# EAGLE design Lower Board (EAGLE 5.12)
PARTNO: 43045-0406
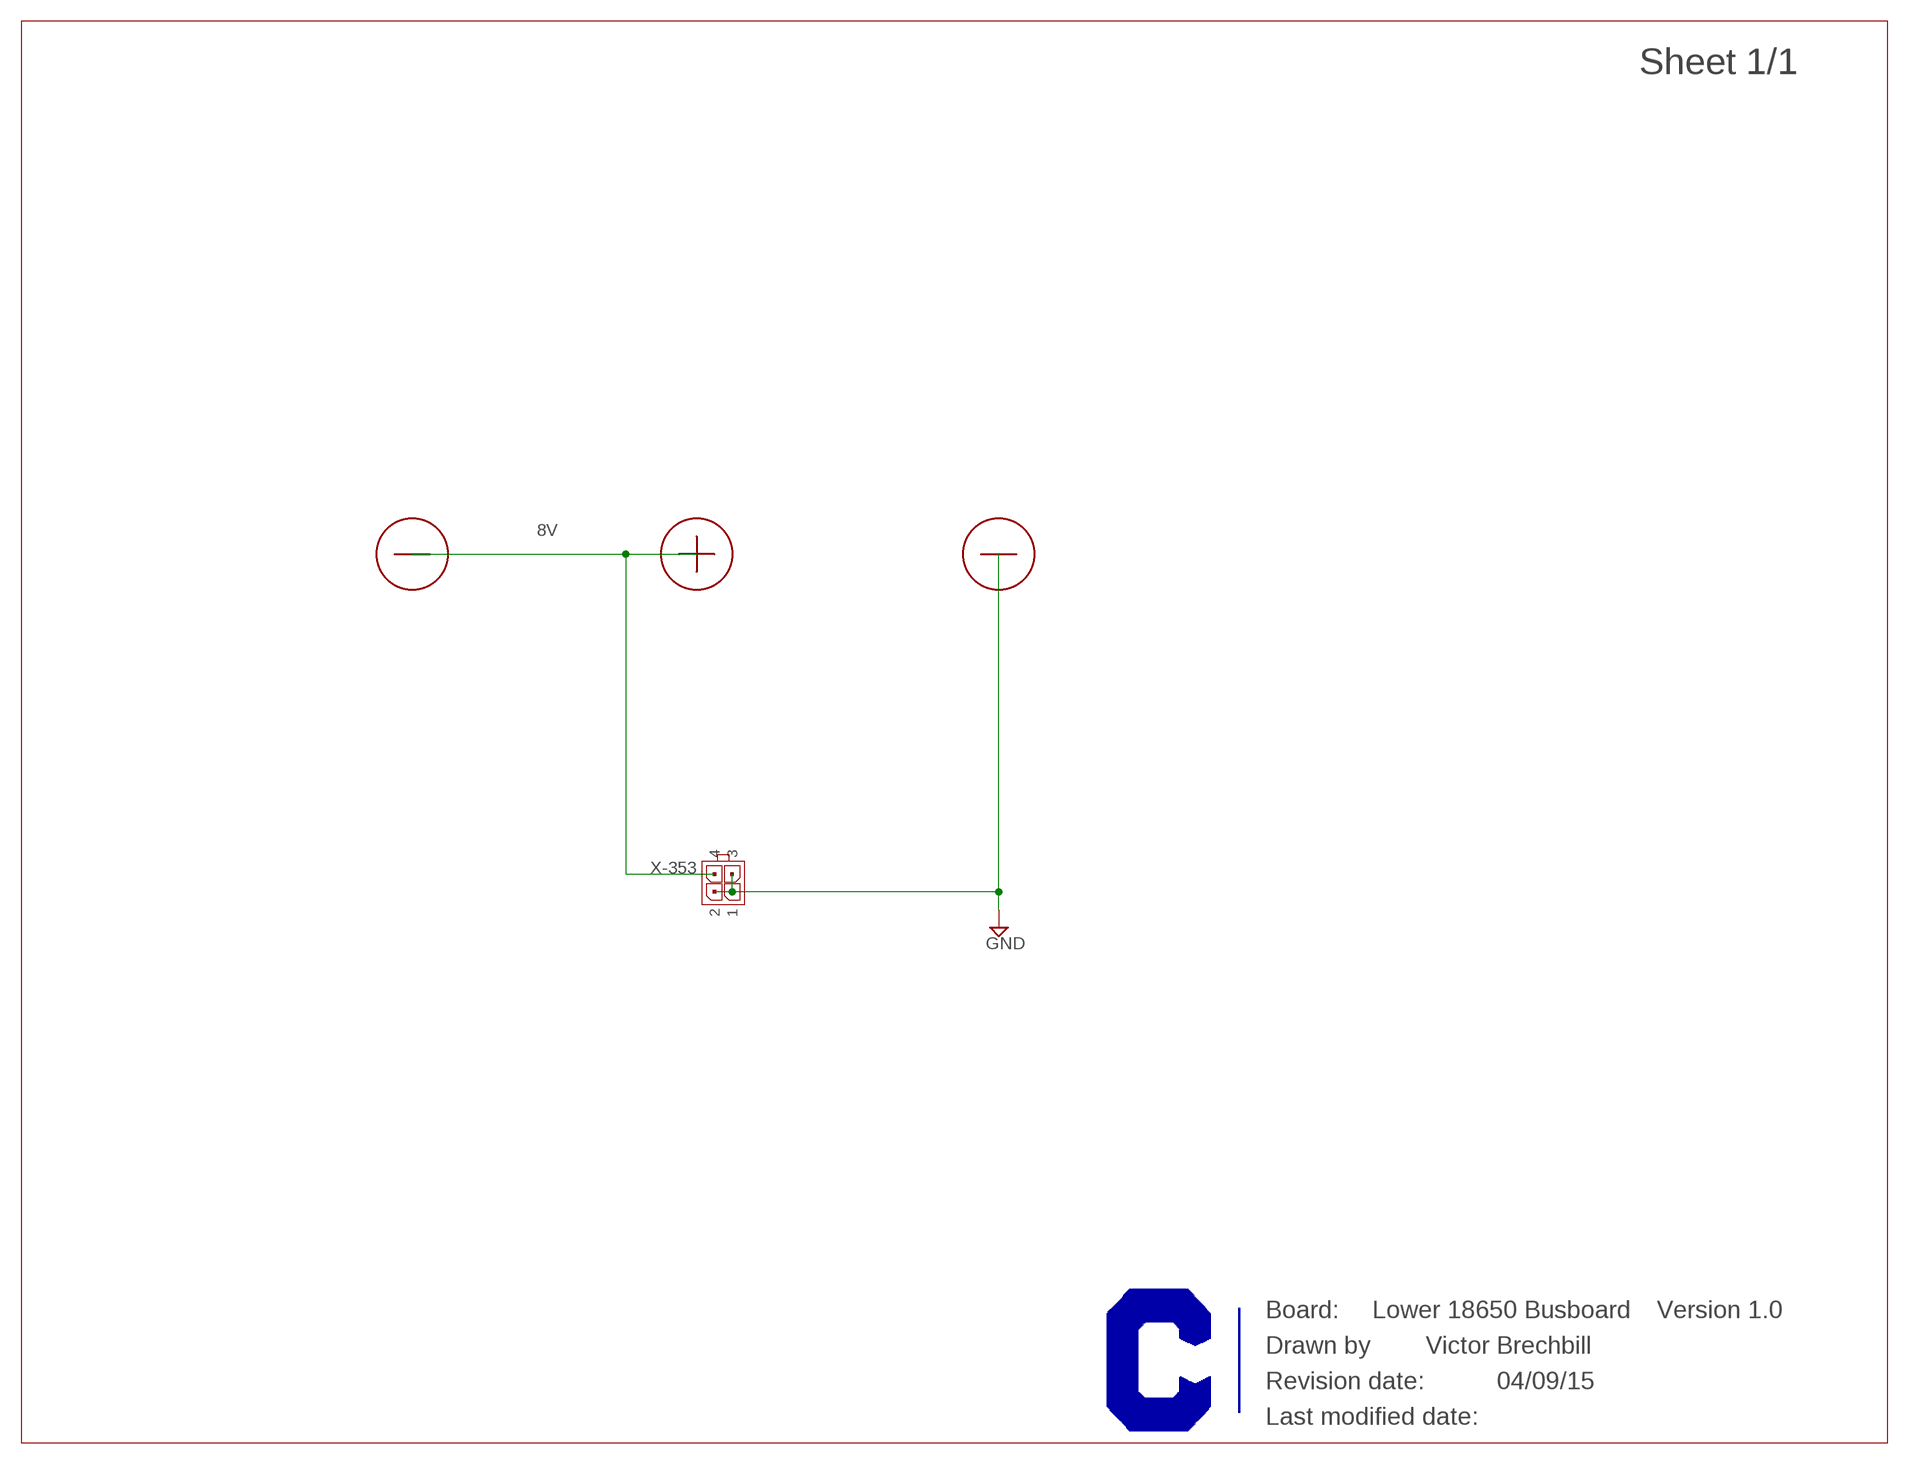
[diagram p0: schematic, sheet 1]

## Parts
U$1  CURRENT-C-LETTER-LANDSCAPE  [BLANK]
U$2  18650_MINUS  [BATTERY_CONTACT]
U$3  18650_MINUS  [BATTERY_CONTACT]
U$4  18650_PLUS  [BATTERY_CONTACT]
X-353  MICROFIT-04-DUAL-RA-SMD-CLIP_RETENTION  [MICROFIT-4-DUAL-RA-SMD-CLIP_RETENTION]

## Nets
8V: U$2.P$1 U$4.P$1 X-353.4
GND: U$3.P$1 X-353.1 X-353.2 X-353.3

## Notes on the sheet
- Lower 18650 Busboard | Version 1.0
- Victor Brechbill
- 04/09/15

## Library data of the parts
U$1 = Frames:CURRENT-C-LETTER-LANDSCAPE; BOM: EXCLUDE
U$2 U$3 = Buckeye Current:18650_MINUS: http://www.digikey.com/product-detail/en/5201/5201K-ND/316365
U$4 = Buckeye Current:18650_PLUS: http://www.digikey.com/product-detail/en/5223/5223K-ND/316374
X-353 = Molex:MICROFIT-04-DUAL: Molex MicroFit 3.00mm Pitch Header, Surface Mount, Dual Row, 4 Circuits Molex P/N: 43045-0609 (vert) Drawing: http://www.molex.com/pdm_docs/sd/430450418_sd.pdf (vert) Information: http://www.molex.com/molex/products/datasheet.jsp?part=active/0430450418_PCB_HEADERS.xml (vert)

## Board
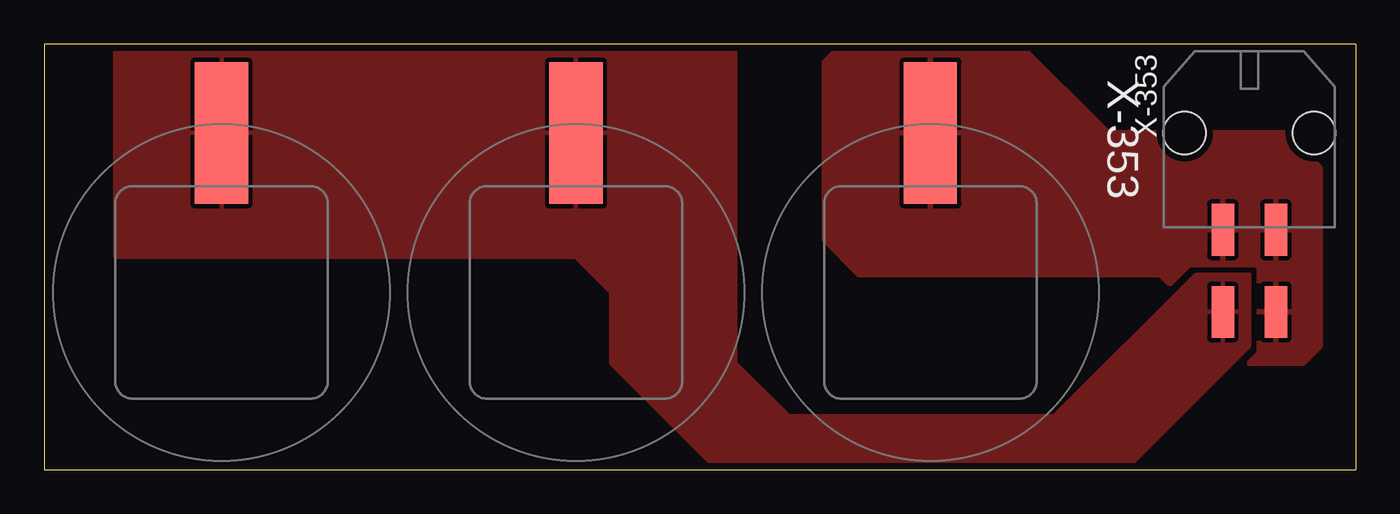
[diagram p1: board, top side]

Size 74 x 24 mm. Coordinates in mm from the lower left corner, seen from the top.
Outline: 0,0 74,0 74,24 0,24 0,0
Copper layers (1*16): Top 0.0356mm / dielectric 1.5011mm / Bottom 0.0356mm
Design rules "OSH Park 2-layer": minimum track width 6mil, minimum drill 13mil, track to track 6mil, track to pad 6mil, pad to pad 6mil, via to via 6mil, smd to smd 6mil, copper to edge 15mil, drill to drill 6mil, minimum pad ring 7mil, minimum via ring 7mil, stop-mask expansion 4mil, vias tented up to drill 0mil, thermal gap 10mil

### Footprints (pad centres in the part's own frame; a part is rotated, then mirrored left to right if it is on the bottom)
BATTERY_CONTACT = smd 3 x 8: P$1 0,-3
MICROFIT-4-DUAL-RA-SMD-CLIP_RETENTION = smd 1.27 x 2.921: 1 1.5,5.47; 2 -1.5,5.47; 3 -1.5,10.1; 4 1.5,10.1 | hole 2.413: 3.65,0; -3.65,0

### Placement (x,y rotation side)
U$1  -40.64,21.59 0 top  (outside the outline)
U$2  10,16 180 top
U$3  50,16 180 top
U$4  30,16 180 top
X-353  68,19 180 top

### Tracks (layer width: path | path; a pad name or v marks a point on that pad's centre or on a via)
8V
  pour Top (isolate 0.305): 4,24 39,24 39,6 42,3 57,3 65,11 68,11 68,7 61,0 38,0 32,6 32,10 30,12 4,12
GND
  pour Top (isolate 0.305, rank 2): 44,23 45,24 55,24 60,19 70,19 72,17 72,7 71,6 68,6 63,11 46,11 44,13

### Text on the board
_tsilk: X-353
_bsilk: Lower 18650 Busboard | Version 1.0